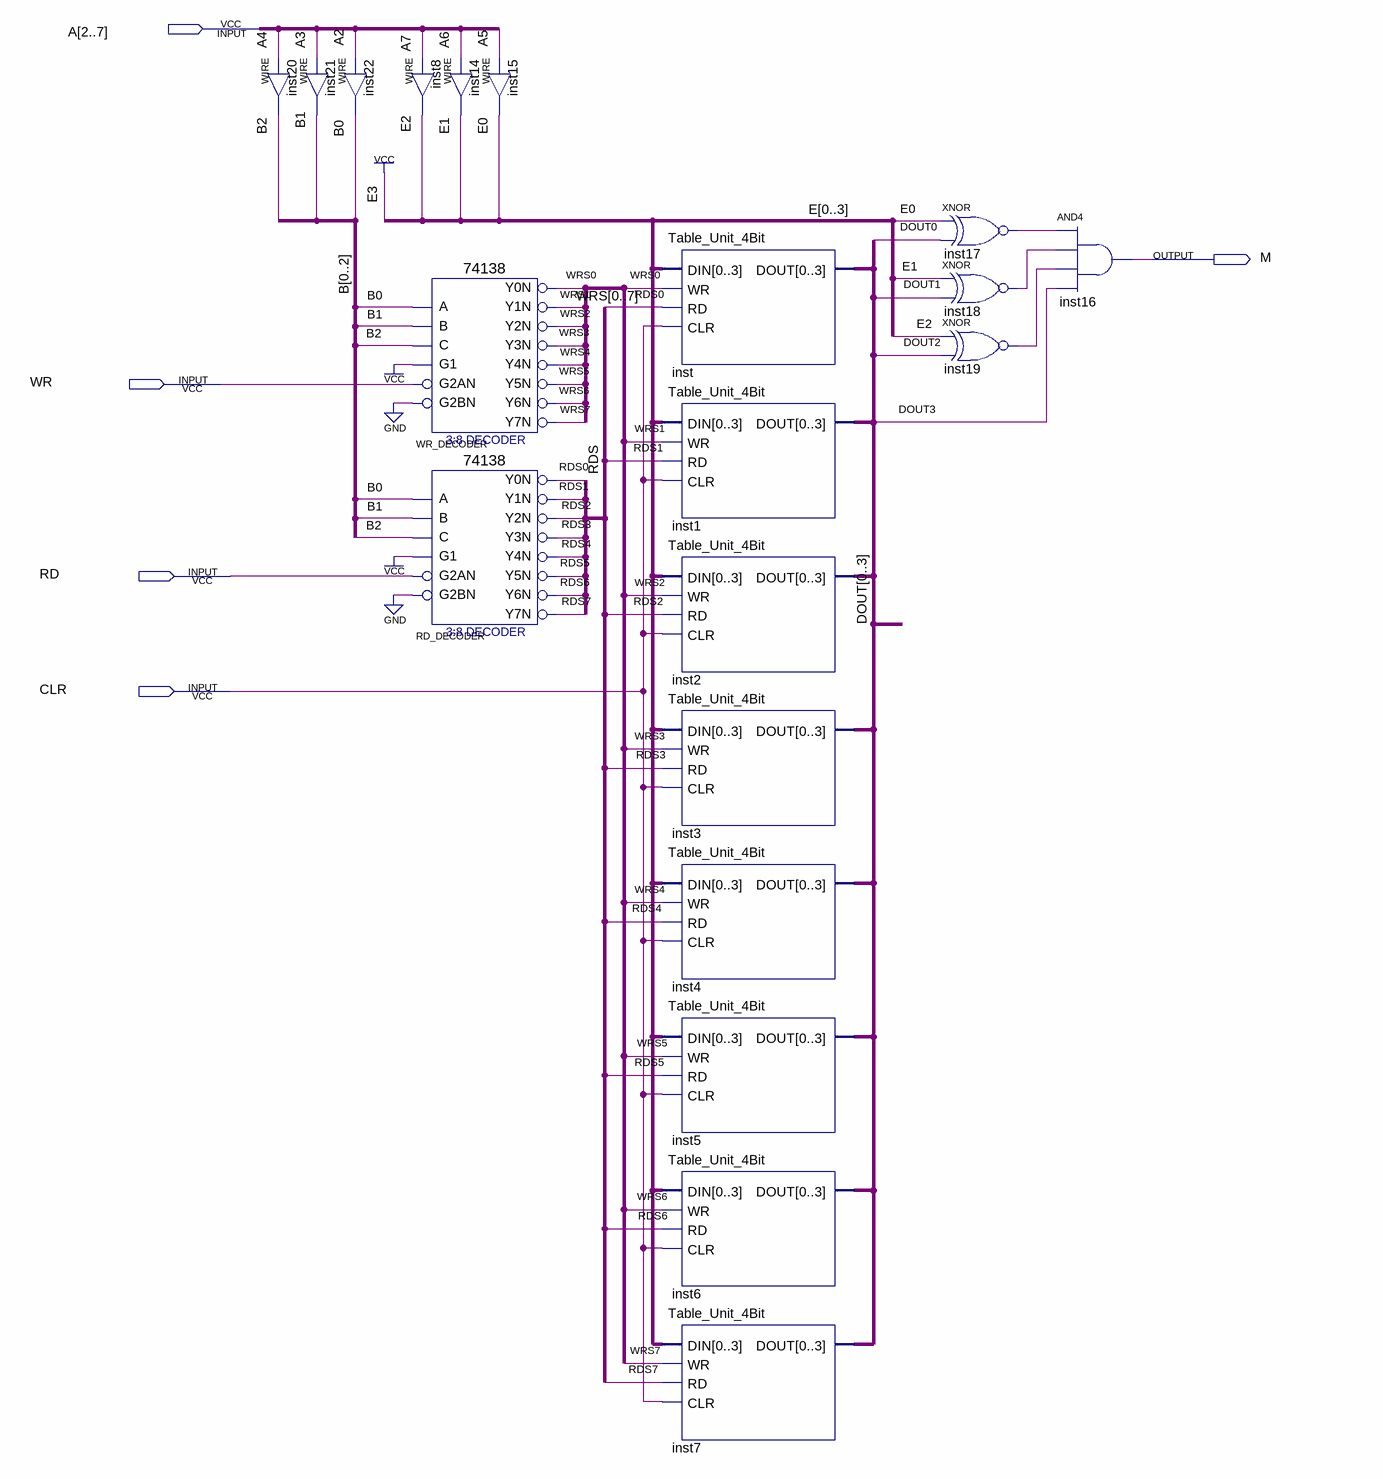
[diagram p0: schematic sheet]
// Quartus schematic Table_Unit_32bit.bdf as structural Verilog: 20 symbols, 5 pins
module Table_Unit_32bit (
  input  [2:7] A,
  input  WR,
  input  RD,
  input  CLR,
  output M
);

  wire inst17_out, inst18_out, inst19_out, RDS0, RDS1, RDS2, RDS3, RDS4, RDS5, RDS6, RDS7;
  wire [2:0] B, E;
  wire [3:0] DOUT;
  wire [7:0] WRS;

  assign B[2] = A[4];  // WIRE inst20
  assign B[1] = A[3];  // WIRE inst21
  assign B[0] = A[2];  // WIRE inst22
  assign E[2] = A[7];  // WIRE inst8
  assign E[1] = A[6];  // WIRE inst14
  \74138  WR_DECODER (
    .A(B[0]), .B(B[1]), .G1(1'b1), .C(B[2]), .G2AN(WR), .G2BN(1'b0), .Y0N(WRS[0]), .Y1N(WRS[1]),
    .Y2N(WRS[2]), .Y3N(WRS[3]), .Y4N(WRS[4]), .Y5N(WRS[5]), .Y6N(WRS[6]), .Y7N(WRS[7]));
  \74138  RD_DECODER (
    .A(B[0]), .B(B[1]), .G1(1'b1), .C(B[2]), .G2AN(RD), .G2BN(1'b0), .Y0N(RDS0), .Y1N(RDS1), .Y2N(RDS2),
    .Y3N(RDS3), .Y4N(RDS4), .Y5N(RDS5), .Y6N(RDS6), .Y7N(RDS7));
  assign E[0] = A[5];  // WIRE inst15
  Table_Unit_4Bit inst (
    .DIN({E[0], E[1], E[2], 1'b1}), .WR(WRS[0]), .RD(RDS0), .CLR(CLR),
    .DOUT({DOUT[0], DOUT[1], DOUT[2], DOUT[3]}));
  Table_Unit_4Bit inst1 (
    .DIN({E[0], E[1], E[2], 1'b1}), .WR(WRS[1]), .RD(RDS1), .CLR(CLR),
    .DOUT({DOUT[0], DOUT[1], DOUT[2], DOUT[3]}));
  Table_Unit_4Bit inst2 (
    .DIN({E[0], E[1], E[2], 1'b1}), .WR(WRS[2]), .RD(RDS2), .CLR(CLR),
    .DOUT({DOUT[0], DOUT[1], DOUT[2], DOUT[3]}));
  Table_Unit_4Bit inst3 (
    .DIN({E[0], E[1], E[2], 1'b1}), .WR(WRS[3]), .RD(RDS3), .CLR(CLR),
    .DOUT({DOUT[0], DOUT[1], DOUT[2], DOUT[3]}));
  Table_Unit_4Bit inst4 (
    .DIN({E[0], E[1], E[2], 1'b1}), .WR(WRS[4]), .RD(RDS4), .CLR(CLR),
    .DOUT({DOUT[0], DOUT[1], DOUT[2], DOUT[3]}));
  Table_Unit_4Bit inst5 (
    .DIN({E[0], E[1], E[2], 1'b1}), .WR(WRS[5]), .RD(RDS5), .CLR(CLR),
    .DOUT({DOUT[0], DOUT[1], DOUT[2], DOUT[3]}));
  Table_Unit_4Bit inst6 (
    .DIN({E[0], E[1], E[2], 1'b1}), .WR(WRS[6]), .RD(RDS6), .CLR(CLR),
    .DOUT({DOUT[0], DOUT[1], DOUT[2], DOUT[3]}));
  Table_Unit_4Bit inst7 (
    .DIN({E[0], E[1], E[2], 1'b1}), .WR(WRS[7]), .RD(RDS7), .CLR(CLR),
    .DOUT({DOUT[0], DOUT[1], DOUT[2], DOUT[3]}));
  xnor inst17 (inst17_out, E[0], DOUT[0]);
  xnor inst18 (inst18_out, E[1], DOUT[1]);
  xnor inst19 (inst19_out, E[2], DOUT[2]);
  and inst16 (M, inst17_out, inst18_out, inst19_out, DOUT[3]);
endmodule
